# EAGLE schematic GroundStationvpatryk (EAGLE 7.7.0)
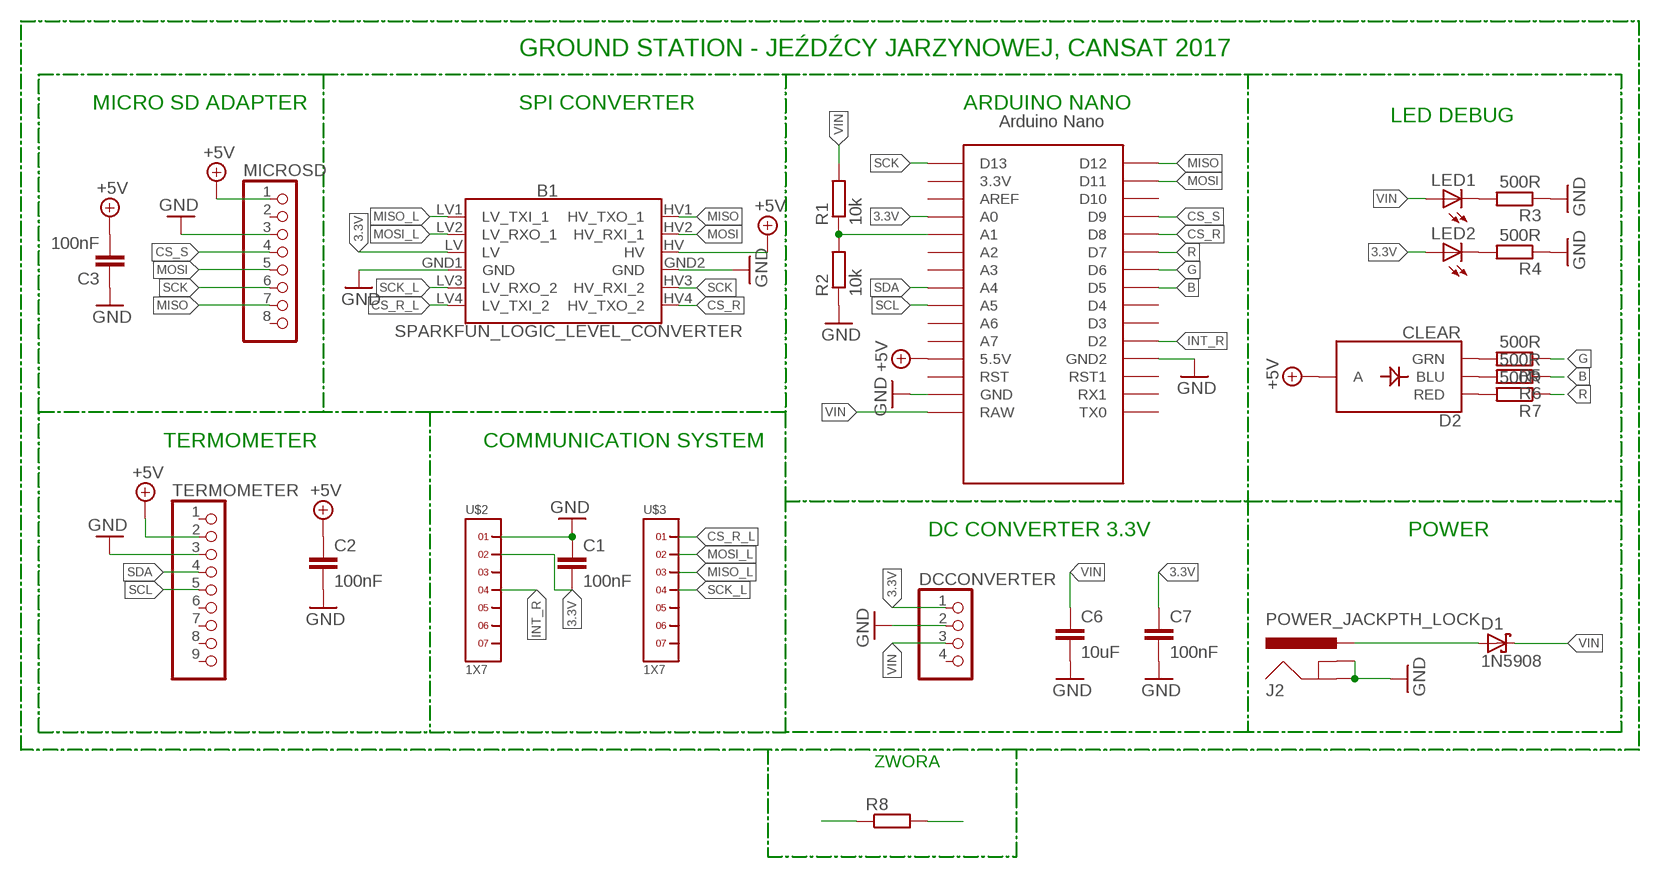
[diagram p0: schematic, sheet 1]

## Parts
B1  SPARKFUN_LOGIC_LEVEL_CONVERTER  [SPARKFUN_LOGIC_LEVEL_CONVERTER]
C1  100nF  C-EU050-025X075  [C050-025X075]
C2  100nF  C-EU050-025X075  [C050-025X075]
C3  100nF  C-EU050-025X075  [C050-025X075]
C6  10uF  C-EU050-025X075  [C050-025X075]
C7  100nF  C-EU050-025X075  [C050-025X075]
D1  1N5908  [C4111-15]
D2  CLEAR  LED-RGB-CACLEAR  [LED-RGB-THRU]
DCCONVERTER  PINHD-1X4  [1X04]
J2  POWER_JACKPTH_LOCK  [POWER_JACK_PTH_LOCK]
LED1  LED3MM  [LED3MM]
LED2  LED3MM  [LED3MM]
MICROSD  PINHD-1X8  [1X08]
R1  10k  R-EU_0207/7  [0207/7]
R2  10k  R-EU_0207/7  [0207/7]
R3  500R  R-EU_0207/7  [0207/7]
R4  500R  R-EU_0207/7  [0207/7]
R5  500R  R-EU_0207/7  [0207/7]
R6  500R  R-EU_0207/7  [0207/7]
R7  500R  R-EU_0207/7  [0207/7]
R8  R-EU_0207/5V  [0207/5V]
TERMOMETER  PINHD-1X9  [1X09]
U$1  NANO  [NANO]
U$2  1X7  [1X7]
U$3  1X7  [1X7]

## Nets
3.3V [3.3V]: B1.LV C1.2 C7.1 DCCONVERTER.1 LED2.A U$1.A0 U$2.2
+5V [+5V]: B1.HV C2.1 C3.2 D2.2(A) MICROSD.1 TERMOMETER.2 U$1.5V(5.5V)
B: R6.1 U$1.D5
CS_R: B1.HV4(HV_TXO_2) U$1.D8
CS_R_L: B1.LV4(LV_TXI_2) U$3.1
CS_S: MICROSD.4 U$1.D9
G: R5.1 U$1.D6
GND [GND]: B1.GND1(GND) B1.GND2(GND) C1.1 C2.2 C3.1 C6.2 C7.2 DCCONVERTER.2 J2.GND J2.GNDBREAK MICROSD.3 R2.1 R3.1 R4.1 TERMOMETER.3 U$1.GND U$1.GND1(GND2) U$2.1
INT_R: U$1.D2 U$2.4
MISO: B1.HV1(HV_TXO_1) MICROSD.7 R8.1 R8.2 U$1.D12
MISO_L: B1.LV1(LV_TXI_1) U$3.3
MOSI: B1.HV2(HV_RXI_1) MICROSD.5 U$1.D11
MOSI_L: B1.LV2(LV_RXO_1) U$3.2
N$1: D1.A J2.PWR
N$4: R1.1 R2.2 U$1.A1
N$5: LED1.K(C) R3.2
N$6: LED2.K(C) R4.2
N$7: D2.3(GRN) R5.2
N$8: D2.4(BLU) R6.2
N$9: D2.1(RED) R7.2
R: R7.1 U$1.D7
SCK: B1.HV3(HV_RXI_2) MICROSD.6 U$1.D13
SCK_L: B1.LV3(LV_RXO_2) U$3.4
SCL: TERMOMETER.5 U$1.A5
SDA: TERMOMETER.4 U$1.A4
VIN [VIN]: C6.1 D1.C DCCONVERTER.3 LED1.A R1.2 U$1.RAW
Unconnected: DCCONVERTER.4 MICROSD.2 MICROSD.8 TERMOMETER.1 TERMOMETER.6 TERMOMETER.7 TERMOMETER.8 TERMOMETER.9 U$1.3.3V U$1.A2 U$1.A3 U$1.A6 U$1.A7 U$1.AREF U$1.D3 U$1.D4 U$1.D10 U$1.ICSP1 U$1.ICSP2 U$1.ICSP3 U$1.ICSP4 U$1.ICSP5 U$1.ICSP6 U$1.RST U$1.RST1 U$1.RX1 U$1.TX0 U$2.3 U$2.5 U$2.6 U$2.7 U$3.5 U$3.6 U$3.7

## Notes on the sheet
- GROUND STATION - JEŹDŹCY JARZYNOWEJ, CANSAT 2017
- MICRO SD ADAPTER | SPI CONVERTER | ARDUINO NANO
- LED DEBUG
- TERMOMETER | COMMUNICATION SYSTEM
- DC CONVERTER 3.3V | POWER
- ZWORA

## Library data of the parts
B1 = sparkfun-boards:SPARKFUN_LOGIC_LEVEL_CONVERTER: SparkFun Logic Level Converter -Bi-Directional This is the mechnical outline for the 3.3V - 5V bi directional logic level converter. SparkFun Products: SparkFun Logic Level Converter - Bi-Directional <�https://www.sparkfun.com/products/12009�>
C1-C3 C6 C7 = resistor:C-EU: CAPACITOR, European symbol
D1 = diode:1N5908: DIODE schottky
D2 = sparkfun-led:LED-RGB-CA: LED-RGB Diffused Common Anode Packages: LED RGB-THRU P-LCC-4-3 LED-TRICOLOR-SMD SparkFun Products: RGB Diffused Common Anode- Diffuse <�[https://www.sparkfun.com/products/10821]�> RGB Diffused Common Anode - Clear <�[https://www.sparkfun.com/products/10820]�> Qduino Mini <�[https://www.sparkfun.com/products/13614]�> Triple Output LED RGB - SMD <�https://www.sparkfun.com/products/7844�>; PROD_ID: DIO-10631
DCCONVERTER = pinhead:PINHD-1X4: PIN HEADER
J2 = sparkfun-connectors:POWER_JACK: Power Jack Connector This is the standard 5.5mm barrel jack for power. The PTH is the most common, proven, reliable, footprint. The Slot footprint only works if the mill layer is transmitted to the PCB fab house so be warned. Here are the connectors we sell at SparkFun: DC Barrel Power Jack/Connector <https://www.sparkfun.com/products/119> (PRT-00119) DC Barrel Power Jack/Connector (SMD) <https://www.sparkfun.com/products/12748> (PRT-12748) DC Barrel Jack Adapter - Breadboard Compatible <https://www.sparkfun.com/products/10811> (PRT-10811) It is used on this SparkFun product (and many, many others): SparkFun RedBoard - Programmed with Arduino <https://www.sparkfun.com/products/12757> (DEV-12757) Also, if you need a mating power supply or connector, please check these out: Wall Adapter Power Supply - 9VDC 650mA <https://www.sparkfun.com/products/298> (TOL-00298) DC Barrel Jack Adapter - Male <https://www.sparkfun.com/products/10287> (PRT-10287); PROD_ID: CONN-08197; SF_ID: PRT-00119
LED1 LED2 = led:LED: LED OSRAM: - CHIPLED LG R971, LG N971, LY N971, LG Q971, LY Q971, LO R971, LY R971 LH N974, LH R974 LS Q976, LO Q976, LY Q976 LO Q996 - Hyper CHIPLED LW Q18S LB Q993, LB Q99A, LB R99A - SideLED LS A670, LO A670, LY A670, LG A670, LP A670 LB A673, LV A673, LT A673, LW A673 LH A674 LY A675 LS A676, LA A676, LO A676, LY A676, LW A676 LS A679, LY A679, LG A679 - Hyper Micro SIDELED® LS Y876, LA Y876, LO Y876, LY Y876 LT Y87S - SmartLED LW L88C, LW L88S LB L89C, LB L89S, LG L890 LS L89K, LO L89K, LY L89K LS L896, LA L896, LO L896, LY L896 - TOPLED LS T670, LO T670, LY T670, LG T670, LP T670 LSG T670, LSP T670, LSY T670, LOP T670, LYG T670 LG T671, LOG T671, LSG T671 LB T673, LV T673, LT T673, LW T673 LH T674 LS T676, LA T676, LO T676, LY T676, LB T676, LH T676, LSB T676, LW T676 LB T67C, LV T67C, LT T67C, LS T67K, LO T67K, LY T67K, LW E67C LS E67B, LA E67B, LO E67B, LY E67B, LB E67C, LV E67C, LT E67C LW T67C LS T679, LY T679, LG T679 LS T770, LO T770, LY T770, LG T770, LP T770 LB T773, LV T773, LT T773, LW T773 LH T774 LS E675, LA E675, LY E675, LS T675 LS T776, LA T776, LO T776, LY T776, LB T776 LHGB T686 LT T68C, LB T68C - Hyper Mini TOPLED® LB M676 - Mini TOPLED Santana® LG M470 LS M47K, LO M47K, LY M47K Source: http://www.osram.convergy.de LUXEON: - LUMILED® LXK2-PW12-R00, LXK2-PW12-S00, LXK2-PW14-U00, LXK2-PW14-V00 LXK2-PM12-R00, LXK2-PM12-S00, LXK2-PM14-U00 LXK2-PE12-Q00, LXK2-PE12-R00, LXK2-PE12-S00, LXK2-PE14-T00, LXK2-PE14-U00 LXK2-PB12-K00, LXK2-PB12-L00, LXK2-PB12-M00, LXK2-PB14-N00, LXK2-PB14-P00, LXK2-PB14-Q00 LXK2-PR12-L00, LXK2-PR12-M00, LXK2-PR14-Q00, LXK2-PR14-R00 LXK2-PD12-Q00, LXK2-PD12-R00, LXK2-PD12-S00 LXK2-PH12-R00, LXK2-PH12-S00 LXK2-PL12-P00, LXK2-PL12-Q00, LXK2-PL12-R00 Source: www.luxeon.com KINGBRIGHT: KA-3528ASYC Source: www.kingbright.com
MICROSD = pinhead:PINHD-1X8: PIN HEADER
R1-R8 = rcl:R-EU_: RESISTOR, European symbol
TERMOMETER = pinhead:PINHD-1X9: PIN HEADER
U$1 = Arduino-clone:NANO: Arduino Nano
U$2 U$3 = headers(2mm):1X7

## Net classes
0 default: width 0.61 mm
1 GND: width 0.813 mm
2 +5V: width 0.813 mm
3 3.3V: width 0.813 mm
4 VIN: width 0.813 mm